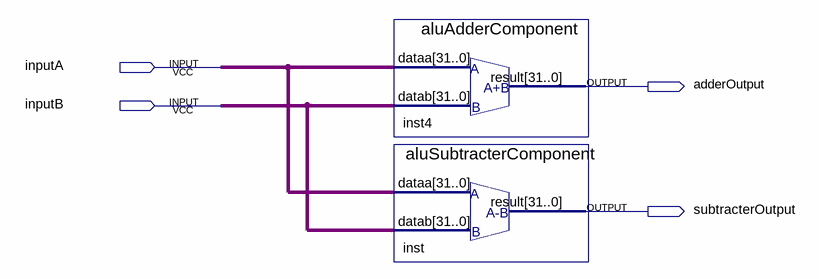
[diagram p0: schematic sheet]
// Quartus schematic aluAdder.bdf as structural Verilog: 2 symbols, 4 pins
module aluAdder (
  input  inputA,
  input  inputB,
  output adderOutput,
  output subtracterOutput
);

  wire [31:0] undriven, undriven_2;

  aluAdderComponent inst4 (.dataa(undriven), .datab(undriven_2), .result(adderOutput));
  aluSubtracterComponent inst (.dataa(undriven), .datab(undriven_2), .result(subtracterOutput));
endmodule
